# Altium schematic sheet bob_v2.SchDoc
size A4; SheetNumber: 7; SheetTotal: 8
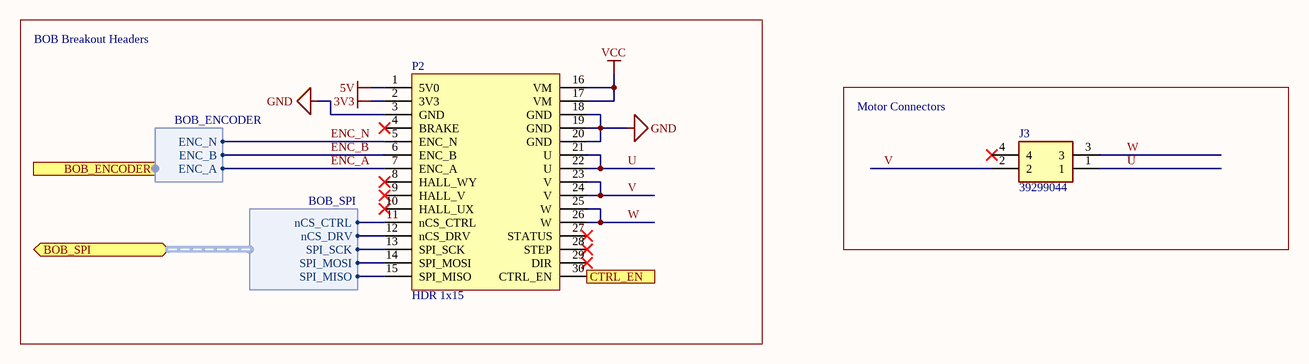
[diagram p0: bob_v2.SchDoc]

## Parts
J3  39299044  [39299044]
P2  HDR 1x15  [TRINAMIC_BOB]

## Blocks framed on the sheet
BOB Breakout Headers: P2
Motor Connectors: J3

## Ports
BOB_ENCODER (harness BOB_ENCODER), BOB_SPI (bidir, harness BOB_SPI), CTRL_EN (in)

## Harnesses
BOB_SPI: nCS_CTRL, nCS_DRV, SPI_SCK, SPI_MOSI, SPI_MISO
BOB_ENCODER: ENC_A, ENC_B, ENC_N

## Nets
3V3: P2.2(3V3)
5V: P2.1(5V0)
GND: P2.3(GND) P2.18(GND) P2.19(GND) P2.20(GND)
VCC: P2.16(VM) P2.17(VM)
CTRL_EN: P2.30(CTRL_EN) ; port CTRL_EN
ENC_A: P2.7(ENC_A) ; port BOB_ENCODER.ENC_A
ENC_B: P2.6(ENC_B) ; port BOB_ENCODER.ENC_B
ENC_N: P2.5(ENC_N) ; port BOB_ENCODER.ENC_N
U: J3.1 P2.21(U) P2.22(U)
V: J3.2 P2.23(V) P2.24(V)
W: J3.3 P2.25(W) P2.26(W)
NetP2_11: P2.11(nCS_CTRL) ; port BOB_SPI.nCS_CTRL
NetP2_12: P2.12(nCS_DRV) ; port BOB_SPI.nCS_DRV
NetP2_13: P2.13(SPI_SCK) ; port BOB_SPI.SPI_SCK
NetP2_14: P2.14(SPI_MOSI) ; port BOB_SPI.SPI_MOSI
NetP2_15: P2.15(SPI_MISO) ; port BOB_SPI.SPI_MISO

Not connected (* = marked no-connect by the designer): J3 4*; P2 4(BRAKE)* 8(HALL_WY)* 9(HALL_V)* 10(HALL_UX)* 27(STATUS)* 28(STEP)* 29(DIR)*

## Library data of the parts
J3 = CN HDR 4POS Molex CN HDR 4POS Molex 39299044 VERT: Molex 39299044 4POS Minifit / dual row, vertical; Supplier 1: Digi-Key; Supplier Part Number 1: WM7336-ND
P2 = TRINAMIC_BOB